# Altium schematic sheet Digital Input.SchDoc: Digital Input Protection
size Letter; Revision: 1.0; PageSetup: Record=PageOptions|CenterHorizontal=True|CenterVertical=True|PrintScale=1.00|XCorrection=1.00|YCorrection=1.00|PrintKind=1|BorderSize=5000000|LeftOffset=0|BottomOffset=0|Orientation=2|PaperLength=1000|PaperWidth=1000|Scale=100|PaperSource=7|PrintQuality=-3|MediaType=1|DitherType=10|PrintScaleMode=1|PaperKind=Letter|PaperIndex=1; ProjectTitle: Data Acquisition System
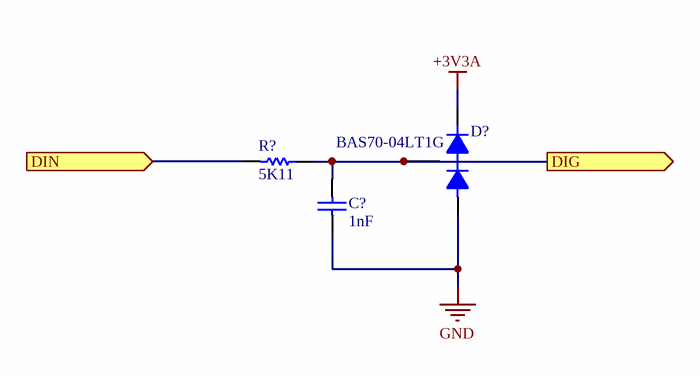
[diagram p0: Digital Input.SchDoc]

## Parts
C?  value 1nF  [CAP-1.6x0.8-0603]  (hidden comment: GRM188R71H102KA01D)
D?  BAS70-04LT1G  [ONSC-SOT-23-3-318-08_V]
R?  value 5K11  [RES-1.6x0.8-0603]  (hidden comment: RC0603FR-075K11L)

## Ports
DIG (out), DIN (in)

## Nets
+3V3A: D?.2(K)
GND: C?.1 D?.1(A)
DIG: C?.2 D?.3(K/A) R?.1 ; port DIG
DIN: R?.2 ; port DIN

## Notes on the sheet
- Date:
- Revision:
- Sheet
- of

## Library data of the parts
C? = GRM188R71H102KA01D: CAP CER 1nF 50V 10% X7R 0603; Supplier 1: Digi-Key; Supplier Part Number 1: 490-1494-1-ND
D? = BAS70-04LT1G: Schottky Diode Array; Supplier 1: Digi-Key; Supplier Part Number 1: BAS70-04LT1GOSCT-ND
R? = RC0603FR-075K11L: RES 0.1W 5K11 1% 0603; Supplier 1: Digi-Key; Supplier Part Number 1: 311-5.11KHRCT-ND